# Altium schematic sheet Band-Pass Filter.SchDoc: Band-Pass Filter
size A4; Organization: Altium Limited; Address1: L3, 12a Rodborough Rd; Address2: Frenchs Forest; Address3: NSW; Address4: Australia 2086; DocumentNumber: 1; SheetNumber: 1; SheetTotal: 1
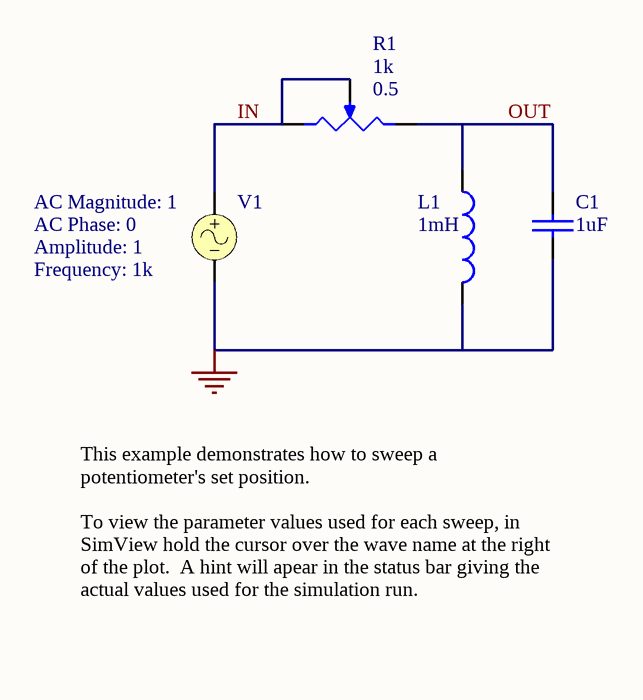
[diagram p0: Band-Pass Filter.SchDoc]

## Parts
C1  value 1uF  (hidden comment: CAP)
L1  value 1mH  (hidden comment: INDUCTOR)
R1  value 1k  Set Position: 0.5  (hidden comment: RPOT)
V1  AC Magnitude: 1  AC Phase: 0  Frequency: 1k  (hidden comment: VSIN)

## Nets
GND: C1.2 L1.2 V1.2
IN: R1.2(BOT) R1.3(TAP) V1.1
OUT: C1.1 L1.1 R1.1(TOP)

## Notes on the sheet
- This example demonstrates how to sweep a potentiometer's set position.
  To view the parameter values used for each sweep, in SimView hold the cursor over the wave name at the right of the plot.  A hint will apear in the status bar giving the actual values used for the simulation run.
- Title
- Size:
- Date:
- A4
- Number:
- Time:
- Revision:
- Sheet
- of
- File:

## Library data of the parts
C1 = CAP: Capacitor
R1 = RPOT: Potentiometer
V1 = VSIN: Sinusoidal Voltage Source; Amplitude: 1